# Altium schematic sheet kill-switches_schematic.SchDoc: Kill-Switches
size A4; Organization: UFSC; DocumentNumber: 7; SheetNumber: 7; SheetTotal: 8
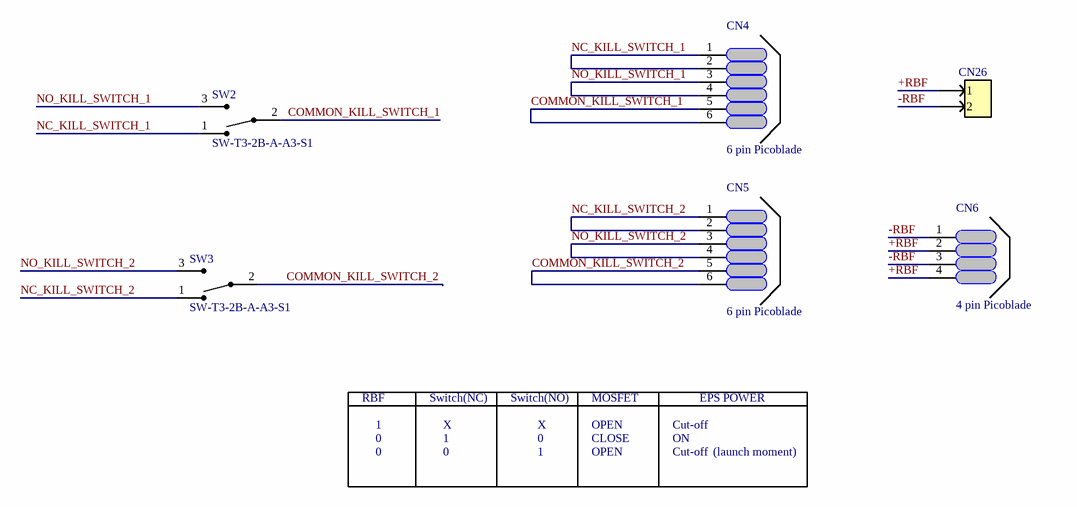
[diagram p0: kill-switches_schematic.SchDoc]

## Parts
CN4  6 pin Picoblade  [PICO BLADE 0532610671]
CN5  6 pin Picoblade  [PICO BLADE 0532610671]
CN6  4 pin Picoblade  [PICO BLADE 0532610471]
CN26  JST 2 position header 2.5mm  [B2B-XH-A-M(LF)(SN)]  (value not drawn)
SW2  SW-T3-2B-A-A3-S1  [SW-T3-2B-A-A3-S1]
SW3  SW-T3-2B-A-A3-S1  [SW-T3-2B-A-A3-S1]

## Nets
+RBF: CN6.2 CN6.4 CN26.1
-RBF: CN6.1 CN6.3 CN26.2
COMMON_KILL_SWITCH_1: CN4.5 CN4.6 SW2.2(COM)
COMMON_KILL_SWITCH_2: CN5.5 CN5.6 SW3.2(COM)
NC_KILL_SWITCH_1: CN4.1 CN4.2 SW2.1
NC_KILL_SWITCH_2: CN5.1 CN5.2 SW3.1
NO_KILL_SWITCH_1: CN4.3 CN4.4 SW2.3
NO_KILL_SWITCH_2: CN5.3 CN5.4 SW3.3

## Notes on the sheet
- RBF
- Switch(NC)
- Switch(NO)
- MOSFET
- EPS POWER
- 1
- 0
- X
- OPEN
- CLOSE
- Cut-off
- ON
- (launch moment)
- Project:
- SpaceLab - Federal University of Santa Catarina
- Title:
- Designed by:
- Project Code:
- Date:
- Revision:
- Sheet
- of
- Size:
- A4

## Library data of the parts
CN4 CN5 = 53398-0671: 1.25mm Pitch PicoBlade™ Header, Surface Mount, Vertical, 6 Circuits; Manufacturer: Molex; Body Plating: Tin; Contact Resistance: 20mR; Voltage Rating: 125V; Current Rating: 1A; Number of Positions: 6; Insulation Resistance: 100MR; Gender: Male; Glow Wire Compliant: Non-compliant; Supplier 1: Digi-Key; Supplier Part Number 1: WM7610DKR-ND; Stock 1: 21086; Pricing 1: 1=1.39, 10=1.26, 100=1.0802, 500=0.90014 (USD); Mount: Surface Mount; Color: Natural; Contact Plating: Tin; Contact Material: Bronze,Tin; Housing Color: Natural; Housing Material: Nylon; Min Operating Temperature: -40°C; Max Operating Temperature: 85°C; Packaging: Tape and Reel; Number of Rows: 1; Voltage Rating (AC): 125V; Package Quantity: 1000; Termination: Solder; Number of Contacts: 6; Working Voltage: 125V; Orientation: Vertical; Number of Circuits: 6; Voltage Rating (DC): 125V; Lead Pitch: 1.25mm; Pitch: 1.25mm; Radiation Hardening: No; REACH SVHC: Unknown; Lead Free: Lead Free; Flammability Rating: UL94 V-0; ComponentLink1URL: https://www.molex.com/pdm_docs/sd/533980671_sd.pdf?src-supplier=Digi-Key; ComponentLink1Description: https://www.molex.com/pdm_docs/sd/533980671_sd.pdf?src-supplier=Digi-Key; Supplier 2: Mouser; Supplier Part Number 2: 538-53398-0671; Stock 2: 26; Pricing 2: 1=1.15, 10=1.01, 100=0.864, 500=0.727, 1000=0.427, 2000=0.374 (USD); Manufacturer Part Number: 53398-0671
CN6 = 0533980471: 1.25mm Pitch PicoBlade™ Header, Surface Mount, Vertical, 4 Circuits; Manufacturer: Molex; Manufacturer Part Number: 53398-0471; N of Positions: 4; Body Plating: Tin; Gender: Male; Current Rating: 1A; Voltage Rating: 125V; Contact Resistance: 20mR; Insulation Resistance: 100MR; Glow Wire Compliant: Non-compliant; Pitch: 1.25mm; Mount Type: SMD; Value: 0533980471; Supplier 1: Digi-Key; Supplier Part Number 1: WM7608CT-ND; Stock 1: 21236; Pricing 1: 1=1.19, 10=1.044, 100=0.901, 500=0.73716 (USD); Mount: Surface Mount; Contact Plating: Tin; Contact Material: Bronze,Tin,Brass; Color: Natural; Housing Color: Natural; Housing Material: Nylon; Min Operating Temperature: -40°C; Max Operating Temperature: 85°C; Number of Rows: 1; Packaging: Tape and Reel; Number of Positions: 4; Termination: Solder; Package Quantity: 1000; Voltage Rating (AC): 125V; Number of Contacts: 4; Working Voltage: 125V; Orientation: Vertical; Number of Circuits: 4; Voltage Rating (DC): 125V; Lead Pitch: 1.25mm; Radiation Hardening: No; Flammability Rating: UL94 V-0; REACH SVHC: Unknown; Lead Free: Lead Free; ComponentLink1URL: http://www.mouser.com/ds/2/276/0533980471_PCB_HEADERS-171069.pdf?src-supplier=Mouser; ComponentLink1Description: http://www.mouser.com/ds/2/276/0533980471_PCB_HEADERS-171069.pdf?src-supplier=Mouser; ComponentLink2URL: http://www.jameco.com/Jameco/Products/ProdDS/1932627.pdf?src-supplier=Jameco; ComponentLink2Description: http://www.jameco.com/Jameco/Products/ProdDS/1932627.pdf?src-supplier=Jameco; ComponentLink3URL: https://www.distrelec.biz/Web/Downloads/46/_e/gf116833-116846_e.pdf?mime=application%2Fpdf&src-supplier=Distrelec; ComponentLink3Description: https://www.distrelec.biz/Web/Downloads/46/_e/gf116833-116846_e.pdf?mime=application%2Fpdf&src-supplier=Distrelec; ComponentLink4URL: http://www.molex.com/webdocs/datasheets/pdf/en-us/0533980471_PCB_HEADERS.pdf?src-supplier=Element14; ComponentLink4Description: http://www.molex.com/webdocs/datasheets/pdf/en-us/0533980471_PCB_HEADERS.pdf?src-supplier=Element14; ComponentLink5URL: http://www.farnell.com/datasheets/1867381.pdf?src-supplier=Element14; ComponentLink5Description: http://www.farnell.com/datasheets/1867381.pdf?src-supplier=Element14; ComponentLink6URL: http://uk.rs-online.com/webdocs/13c4/0900766b813c4500.pdf?src-supplier=RSComponents; ComponentLink6Description: http://uk.rs-online.com/webdocs/13c4/0900766b813c4500.pdf?src-supplier=RSComponents; ComponentLink7URL: http://www.molex.com/webdocs/datasheets/pdf/en-us/0533980471_PCB_HEADERS.pdf?src-supplier=Farnell; ComponentLink7Description: http://www.molex.com/webdocs/datasheets/pdf/en-us/0533980471_PCB_HEADERS.pdf?src-supplier=Farnell; ComponentLink8URL: http://www.farnell.com/datasheets/2697809.pdf?src-supplier=Element14; ComponentLink8Description: http://www.farnell.com/datasheets/2697809.pdf?src-supplier=Element14; ComponentLink9URL: http://www.molex.com/webdocs/datasheets/pdf/en-us/0533980471_PCB_HEADERS.pdf?src-supplier=Avnet; ComponentLink9Description: http://www.molex.com/webdocs/datasheets/pdf/en-us/0533980471_PCB_HEADERS.pdf?src-supplier=Avnet; ComponentLink10URL: http://www.molex.com/webdocs/datasheets/pdf/en-us/0533980471_PCB_HEADERS.pdf?src-supplier=Avnet+Europe; ComponentLink10Description: http://www.molex.com/webdocs/datasheets/pdf/en-us/0533980471_PCB_HEADERS.pdf?src-supplier=Avnet+Europe; Supplier 2: Mouser; Supplier Part Number 2: 538-53398-0471; Stock 2: 43680; Pricing 2: 1=0.98, 10=0.832, 100=0.716, 500=0.6, 1000=0.391, 2000=0.342 (USD)
CN26 = B2B-XH-A-M(LF)(SN): CONN HEADER TOP 2POS 2.5MM GRN; Number of Positions: 2; Connector Type: Male Pin; Pitch: 0.098inch; Supplier 1: Digi-Key; Supplier Part Number 1: 455-2879-ND; Manufacturer: JST; Stock 1: 5564; Pricing 1: 1=0.17, 10=0.157, 100=0.0966, 500=0.07998, 1000=0.06999, 5000=0.05999, 10000=0.05832 (USD); Mount: Through Hole; Color: Natural; Contact Plating: Tin; Packaging: Bulk; Number of Rows: 1; Termination: Press-Fit; Fastening Type: Detent; Package Quantity: 1000; Manufacturer Part Number: B2B-XH-A-M(LF)(SN); ComponentLink1Description: http://www.jst-mfg.com/product/pdf/eng/eXH.pdf; ComponentLink1URL: http://www.jst-mfg.com/product/pdf/eng/eXH.pdf